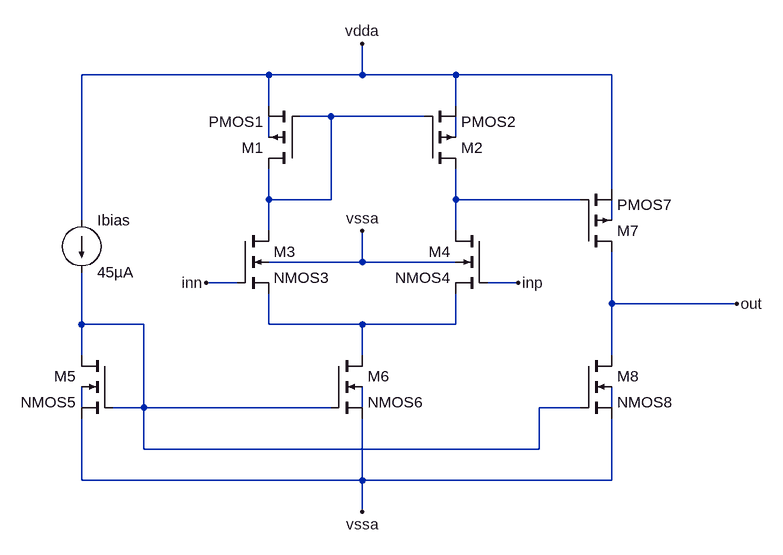
[diagram p0: schematic CMOSamp.asc]
CMOSamp.asc, the LTspice schematic file:
Version 4
SHEET 1 1776 996
WIRE 80 -16 -208 -16
WIRE 224 -16 224 -64
WIRE 224 -16 80 -16
WIRE 368 -16 224 -16
WIRE 608 -16 368 -16
WIRE 80 32 80 -16
WIRE 368 32 368 -16
WIRE 176 48 128 48
WIRE 320 48 176 48
WIRE 80 80 80 48
WIRE 368 80 368 48
WIRE 608 160 608 -16
WIRE 80 176 80 128
WIRE 176 176 176 48
WIRE 176 176 80 176
WIRE 368 176 368 128
WIRE 560 176 368 176
WIRE -208 208 -208 -16
WIRE 608 208 608 176
WIRE 80 224 80 176
WIRE 368 224 368 176
WIRE 224 272 224 224
WIRE 224 272 80 272
WIRE 368 272 224 272
WIRE 32 304 -16 304
WIRE 464 304 416 304
WIRE 608 336 608 256
WIRE 800 336 608 336
WIRE -208 368 -208 288
WIRE -112 368 -208 368
WIRE 80 368 80 320
WIRE 224 368 80 368
WIRE 368 368 368 320
WIRE 368 368 224 368
WIRE -208 416 -208 368
WIRE 224 416 224 368
WIRE 608 416 608 336
WIRE -208 496 -208 464
WIRE -112 496 -112 368
WIRE -112 496 -160 496
WIRE 176 496 -112 496
WIRE 224 496 224 464
WIRE 560 496 496 496
WIRE 608 496 608 464
WIRE -112 560 -112 496
WIRE 496 560 496 496
WIRE 496 560 -112 560
WIRE -208 608 -208 512
WIRE 224 608 224 512
WIRE 224 608 -208 608
WIRE 608 608 608 512
WIRE 608 608 224 608
WIRE 224 656 224 608
FLAG 224 224 vssa
FLAG 224 -64 vdda
FLAG 224 656 vssa
FLAG -16 304 inn
FLAG 464 304 inp
FLAG 800 336 out
SYMBOL pmos4 128 128 R180
SYMATTR InstName M1
SYMATTR Value PMOS1
SYMBOL pmos4 320 128 M180
SYMATTR InstName M2
SYMATTR Value PMOS2
SYMBOL nmos4 32 224 R0
SYMATTR InstName M3
SYMATTR Value NMOS3
SYMBOL nmos4 416 224 M0
SYMATTR InstName M4
SYMATTR Value NMOS4
SYMBOL nmos4 -160 416 M0
SYMATTR InstName M5
SYMATTR Value NMOS5
SYMBOL nmos4 176 416 R0
SYMATTR InstName M6
SYMATTR Value NMOS6
SYMBOL pmos4 560 256 M180
SYMATTR InstName M7
SYMATTR Value PMOS7
SYMBOL nmos4 560 416 R0
SYMATTR InstName M8
SYMATTR Value NMOS8
SYMBOL current -208 208 R0
SYMATTR InstName Ibias
SYMATTR Value 45µA

The netlist it stands for:
* CMOSamp.asc
M1 N001 N001 vdda N002 PMOS1
M2 N004 N001 vdda N003 PMOS2
M3 N001 inn N007 vssa NMOS3
M4 N004 inp N007 vssa NMOS4
M5 N006 N006 vssa N008 NMOS5
M6 N007 N006 vssa N009 NMOS6
M7 out N004 vdda N005 PMOS7
M8 out N006 vssa N010 NMOS8
Ibias vdda N006 45µA
.model NMOS NMOS
.model PMOS PMOS
.lib standard.mos
.backanno
.end